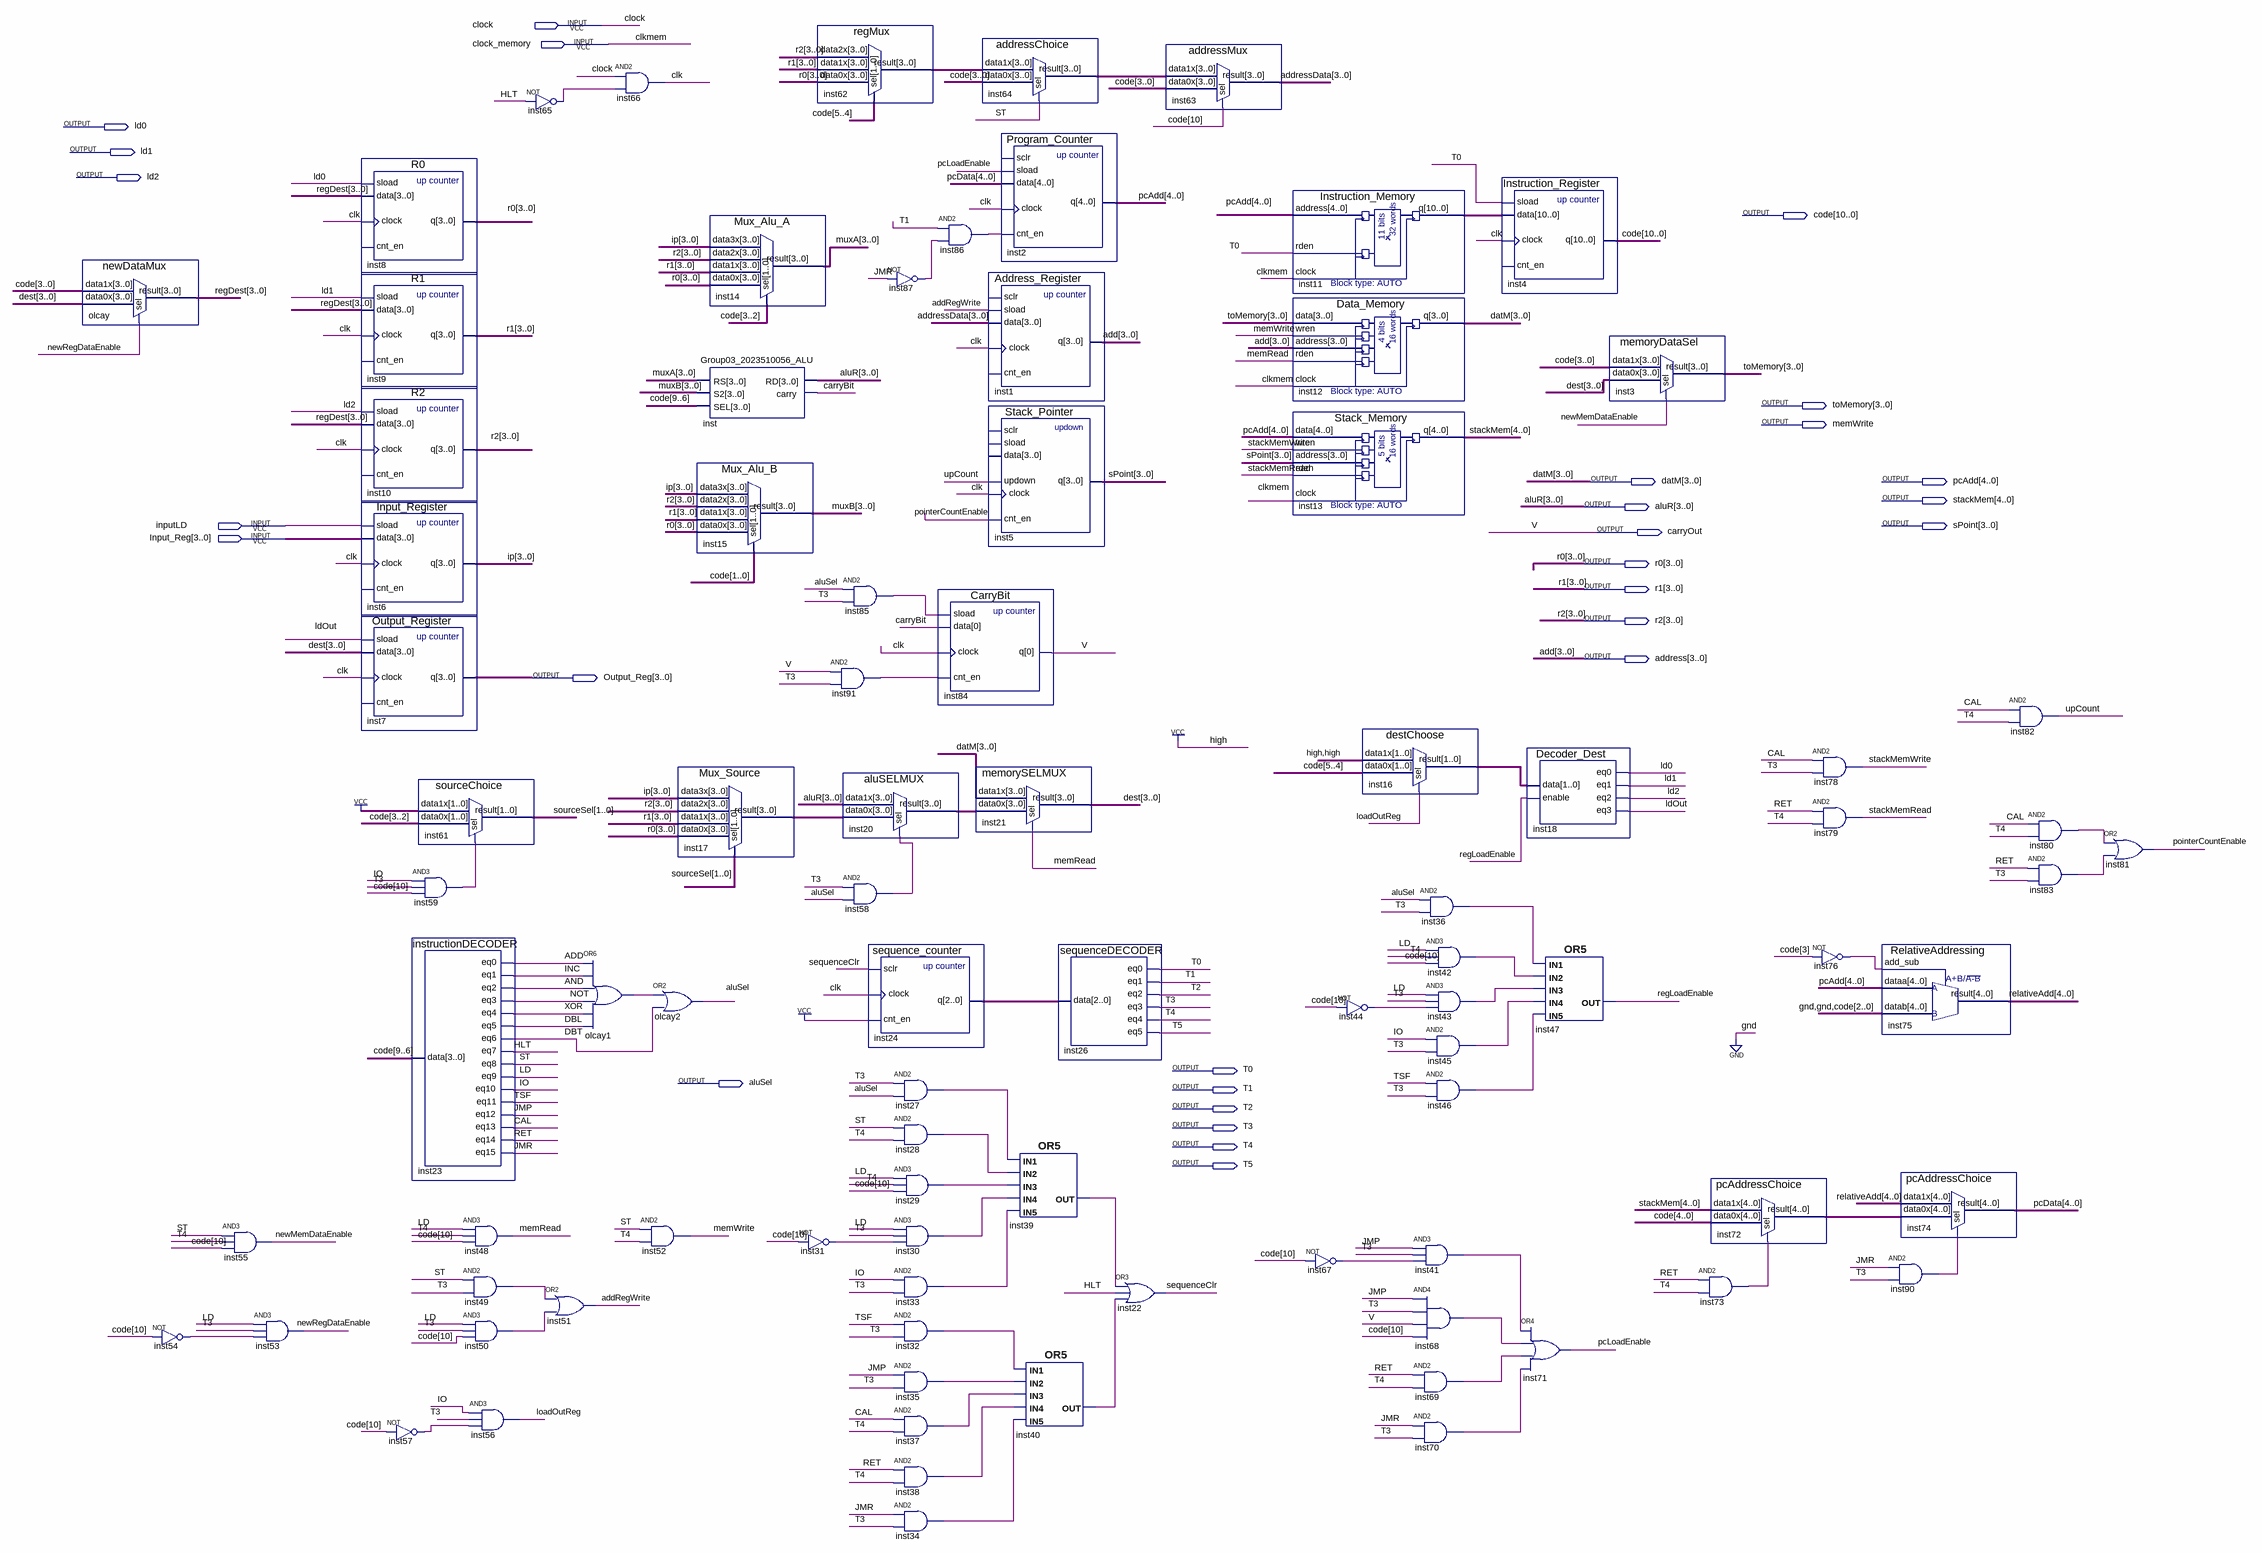
[diagram p0: schematic sheet]
// Quartus schematic Group03_2022510066_Atakan_Kahraman_BUS.bdf as structural Verilog: 89 symbols, 28 pins
module Group03_2022510066_Atakan_Kahraman_BUS (
  input  clock,
  input  clock_memory,
  input  inputLD,
  input  [3:0] Input_Reg,
  output ld0,
  output ld1,
  output ld2,
  output [10:0] code,
  output [3:0] toMemory,
  output memWrite,
  output [3:0] datM,
  output [4:0] pcAdd,
  output [4:0] stackMem,
  output [3:0] aluR,
  output [3:0] sPoint,
  output carryOut,
  output [3:0] r0,
  output [3:0] r1,
  output [3:0] r2,
  output [3:0] address,
  output [3:0] Output_Reg,
  output T0,
  output aluSel,
  output T1,
  output T2,
  output T3,
  output T4,
  output T5
);

  wire add, addRegWrite, AND, CAL, carryBit, clk, DBL, DBT, HLT, INC, inst27_out, inst28_out, inst29_out,
       inst30_out, inst31_out, inst32_out, inst33_out, inst34_out, inst35_out, inst36_out, inst37_out,
       inst38_out, inst39_out, inst40_out, inst41_out, inst42_out, inst43_out, inst44_out, inst45_out,
       inst46_out, inst49_out, inst50_out, inst54_out, inst57_out, inst58_out, inst59_out, inst65_out,
       inst67_out, inst68_out, inst69_out, inst70_out, inst73_out, inst76_out, inst80_out, inst83_out,
       inst85_out, inst86_out, inst87_out, inst90_out, inst91_out, IO, JMP, JMR, LD, ldOut, loadOutReg,
       memRead, newMemDataEnable, newRegDataEnable, NOT, olcay1_out, pcLoadEnable, pointerCountEnable,
       regLoadEnable, RET, sequenceClr, ST, stackMemRead, stackMemWrite, TSF, upCount, XOR;
  wire [1:0] inst16_result, sourceSel;
  wire [2:0] inst24_q;
  wire [3:0] addressData, dest, inst17_result, inst20_result, inst62_result, inst64_result, ip, muxA, muxB,
       regDest;
  wire [4:0] inst72_result, pcData, relativeAdd;
  wire [10:0] inst11_q;

  newDataMux olcay (.data1x(code[3:0]), .data0x(dest), .sel(newRegDataEnable), .result(regDest));
  not inst54 (inst54_out, code[10]);
  and inst55 (newMemDataEnable, ST, T4, code[10]);
  and inst53 (newRegDataEnable, LD, T3, inst54_out);
  R0 inst8 (.sload(ld0), .data(regDest), .clock(clk), .q(r0));  // open: cnt_en
  R1 inst9 (.sload(ld1), .data(regDest), .clock(clk), .q(r1));  // open: cnt_en
  R2 inst10 (.sload(ld2), .data(regDest), .clock(clk), .q(r2));  // open: cnt_en
  Input_Register inst6 (.sload(inputLD), .data(Input_Reg), .clock(clk), .q(ip));  // open: cnt_en
  Output_Register inst7 (.sload(ldOut), .data(dest), .clock(clk), .q(Output_Reg));  // open: cnt_en
  not inst57 (inst57_out, code[10]);
  sourceChoice inst61 (.data1x(2'b11), .data0x(code[3:2]), .sel(inst59_out), .result(sourceSel));
  and inst59 (inst59_out, IO, T3, code[10]);
  instructionDECODER inst23 (
    .data(code[9:6]), .eq0(add), .eq1(INC), .eq2(AND), .eq3(NOT), .eq4(XOR), .eq5(DBL), .eq6(DBT), .eq7(HLT),
    .eq8(ST), .eq9(LD), .eq10(IO), .eq11(TSF), .eq12(JMP), .eq13(CAL), .eq14(RET), .eq15(JMR));
  and inst48 (memRead, LD, T4, code[10]);
  and inst49 (inst49_out, ST, T3);
  and inst50 (inst50_out, LD, T3, code[10]);
  and inst56 (loadOutReg, IO, T3, inst57_out);
  not inst65 (inst65_out, HLT);
  or inst51 (addRegWrite, inst49_out, inst50_out);
  or olcay1 (olcay1_out, add, INC, AND, NOT, XOR, DBL);
  and inst66 (clk, clock, inst65_out);
  or olcay2 (aluSel, olcay1_out, DBT);
  and inst52 (memWrite, ST, T4);
  Mux_Alu_A inst14 (.data3x(ip), .data2x(r2), .data1x(r1), .data0x(r0), .sel(code[3:2]), .result(muxA));
  Group03_2023510056_ALU inst (.RS(muxA), .S2(muxB), .SEL(code[9:6]), .RD(aluR), .carry(carryBit));
  Mux_Alu_B inst15 (.data3x(ip), .data2x(r2), .data1x(r1), .data0x(r0), .sel(code[1:0]), .result(muxB));
  Mux_Source inst17 (.data3x(ip), .data2x(r2), .data1x(r1), .data0x(r0), .sel(sourceSel), .result(inst17_result));
  not inst31 (inst31_out, code[10]);
  regMux inst62 (.data2x(r2), .data1x(r1), .data0x(r0), .sel(code[5:4]), .result(inst62_result));
  and inst85 (inst85_out, aluSel, T3);
  and inst91 (inst91_out, carryOut, T3);
  aluSELMUX inst20 (.data1x(aluR), .data0x(inst17_result), .sel(inst58_out), .result(inst20_result));
  and inst58 (inst58_out, T3, aluSel);
  not inst87 (inst87_out, JMR);
  sequence_counter inst24 (.sclr(sequenceClr), .clock(clk), .cnt_en(1'b1), .q(inst24_q));
  and inst27 (inst27_out, T3, aluSel);
  and inst28 (inst28_out, ST, T4);
  and inst29 (inst29_out, LD, T4, code[10]);
  and inst30 (inst30_out, LD, T3, inst31_out);
  and inst33 (inst33_out, IO, T3);
  and inst32 (inst32_out, TSF, T3);
  and inst35 (inst35_out, JMP, T3);
  and inst37 (inst37_out, CAL, T4);
  and inst38 (inst38_out, RET, T4);
  and inst34 (inst34_out, JMR, T3);
  and inst86 (inst86_out, T1, inst87_out);
  CarryBit inst84 (.sload(inst85_out), .data(carryBit), .clock(clk), .cnt_en(inst91_out), .q(carryOut));
  addressChoice inst64 (.data1x(inst62_result), .data0x(code[3:0]), .sel(ST), .result(inst64_result));
  Program_Counter inst2 (
    .sload(pcLoadEnable), .data(pcData), .clock(clk), .cnt_en(inst86_out), .q(pcAdd));  // open: sclr
  Address_Register inst1 (.sload(addRegWrite), .data(addressData), .clock(clk), .q(address));  // open: sclr, cnt_en
  Stack_Pointer inst5 (
    .updown(upCount), .clock(clk), .cnt_en(pointerCountEnable), .q(sPoint));  // open: sclr, sload, data
  memorySELMUX inst21 (.data1x(datM), .data0x(inst20_result), .sel(memRead), .result(dest));
  or inst39 (inst39_out, inst27_out, inst28_out, inst29_out, inst30_out, inst33_out);
  or inst40 (inst40_out, inst32_out, inst35_out, inst37_out, inst38_out, inst34_out);
  sequenceDECODER inst26 (.data(inst24_q), .eq0(T0), .eq1(T1), .eq2(T2), .eq3(T3), .eq4(T4), .eq5(T5));
  or inst22 (sequenceClr, inst39_out, HLT, inst40_out);
  addressMux inst63 (.data1x(inst64_result), .data0x(code[3:0]), .sel(code[10]), .result(addressData));
  Instruction_Memory inst11 (.address(pcAdd), .rden(T0), .clock(clock_memory), .q(inst11_q));
  Data_Memory inst12 (
    .data(toMemory), .wren(memWrite), .address(address), .rden(memRead), .clock(clock_memory), .q(datM));
  Stack_Memory inst13 (
    .data(pcAdd), .wren(stackMemWrite), .address(sPoint), .rden(stackMemRead), .clock(clock_memory),
    .q(stackMem));
  not inst67 (inst67_out, code[10]);
  destChoose inst16 (.data1x(2'b11), .data0x(code[5:4]), .sel(loadOutReg), .result(inst16_result));
  not inst44 (inst44_out, code[10]);
  and inst36 (inst36_out, aluSel, T3);
  and inst41 (inst41_out, JMP, T3, inst67_out);
  and inst68 (inst68_out, JMP, T3, carryOut, code[10]);
  and inst69 (inst69_out, RET, T4);
  and inst70 (inst70_out, JMR, T3);
  and inst42 (inst42_out, LD, T4, code[10]);
  and inst43 (inst43_out, LD, T3, inst44_out);
  and inst45 (inst45_out, IO, T3);
  and inst46 (inst46_out, TSF, T3);
  Instruction_Register inst4 (.sload(T0), .data(inst11_q), .clock(clk), .q(code));  // open: cnt_en
  or inst71 (pcLoadEnable, inst41_out, inst68_out, inst69_out, inst70_out);
  Decoder_Dest inst18 (.data(inst16_result), .enable(regLoadEnable), .eq0(ld0), .eq1(ld1), .eq2(ld2), .eq3(ldOut));
  or inst47 (regLoadEnable, inst36_out, inst42_out, inst43_out, inst45_out, inst46_out);
  memoryDataSel inst3 (.data1x(code[3:0]), .data0x(dest), .sel(newMemDataEnable), .result(toMemory));
  pcAddressChoice inst72 (.data1x(stackMem), .data0x(code[4:0]), .sel(inst73_out), .result(inst72_result));
  and inst73 (inst73_out, RET, T4);
  and inst78 (stackMemWrite, CAL, T3);
  and inst79 (stackMemRead, RET, T4);
  not inst76 (inst76_out, code[3]);
  RelativeAddressing inst75 (.add_sub(inst76_out), .dataa(pcAdd), .datab({2'b00, code[2:0]}), .result(relativeAdd));
  pcAddressChoice inst74 (.data1x(relativeAdd), .data0x(inst72_result), .sel(inst90_out), .result(pcData));
  and inst90 (inst90_out, JMR, T3);
  and inst82 (upCount, CAL, T4);
  and inst80 (inst80_out, CAL, T4);
  and inst83 (inst83_out, RET, T3);
  or inst81 (pointerCountEnable, inst80_out, inst83_out);

  // Other names for the same wires on the sheet: add[3:0] = address; clkmem = clock_memory; V = carryOut
endmodule
